# Altium project uartto485.PrjPCB
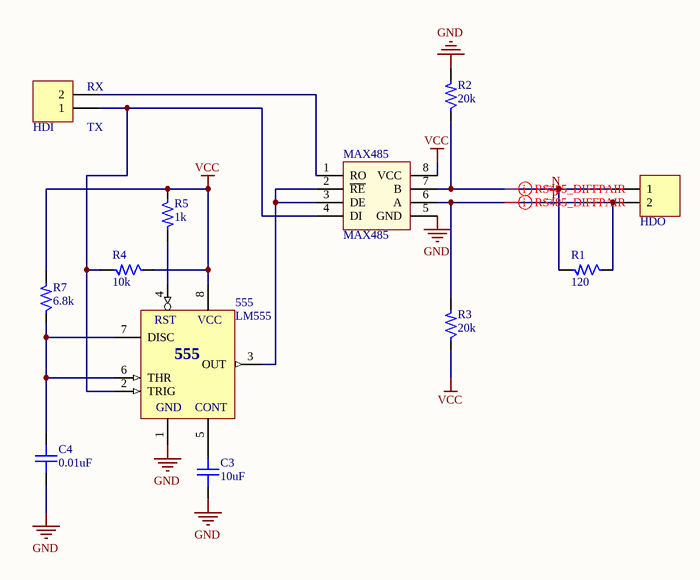
[diagram p0: uartto485.SchDoc]
2 sheets, 19 parts. Net scope: global (net labels, ports and power ports of the same name join across sheets).
Board file: uartto485.PcbDoc
Sheets:
  uartto485.SchDoc
  power.SchDoc

## Sheet uartto485.SchDoc
size A

### Parts
555  LM555  [DIP8/W0.3]
C3  10uF  [CAPC-0603 (1608)]
C4  0.01uF  [CAPC-0603 (1608)]
HDI  Header 2_1  [HED2]  (value not drawn)
HDO  Header 2_1  [HED2]  (value not drawn)
MAX485  MAX485  [DIP8/W0.3]
R1  120  [SM-RES-1206]
R2  20k  [SM-RES-1206]
R3  20k  [SM-RES-1206]
R4  10k  [SM-RES-1206]
R5  1k  [SM-RES-1206]
R7  6.8k  [SM-RES-1206]

### Nets
GND: 555.1(GND) C3.1 C4.1 MAX485.5(GND) R2.2
VCC: 555.8(VCC) MAX485.8(VCC) R3.1 R4.1 R5.1 R7.2
_N: HDO.1 MAX485.7(B) R1.2 R2.1
_P: HDO.2 MAX485.6(A) R1.1 R3.2
Net555_2: 555.2(TRIG) HDI.1 MAX485.4(DI) R4.2
Net555_3: 555.3(OUT) MAX485.2(~{RE}) MAX485.3(DE)
Net555_4: 555.4(RST) R5.2
Net555_5: 555.5(CONT) C3.2
Net555_6: 555.6(THR) 555.7(DISC) C4.2 R7.1
NetHDI_2: HDI.2 MAX485.1(RO)

### Layout directives
differential pair; differential pair class RS485DIFF: _N, _P

### Notes on the sheet
- (near HDI) RX
- (near HDI) TX

### Library data of the parts
555 = LM555: Timer; Value: LM555
C3 C4 = 0603N330J500CT: CAP CER 33pF 50V 5%  0603; MPN: CL10C330JB8NNNC, 0603N330J500CT; CompanyID: VT-01106; Solder: SMT; Value: 33p/50V; Category: CAPACITOR; PinCount: 2
HDI HDO = Header 2_1: Header, 2-Pin; Manufacturer: Generic Components; Class: Connector; Value: Header 2
MAX485 = MAX485: RS232 - RS485 (Same sn75176)
R1-R5 R7 = R: Resistor 1/4W; Value: R1/4W - 1K

## Sheet power.SchDoc
size A
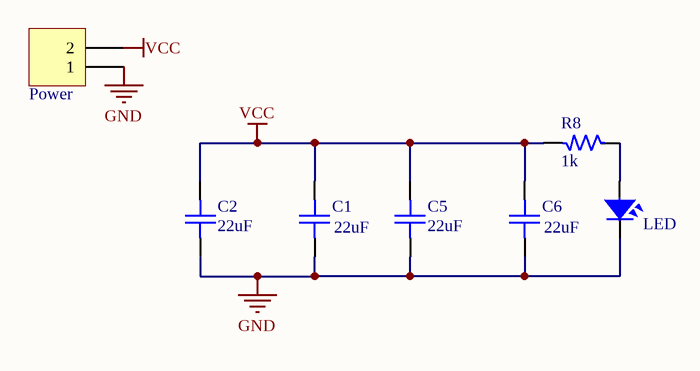
[diagram p1: power.SchDoc]

### Parts
C1  22uF  [CAPC-0603 (1608)]
C2  22uF  [CAPC-0603 (1608)]
C5  22uF  [CAPC-0603 (1608)]
C6  22uF  [CAPC-0603 (1608)]
LED  LED  [LED-3]  (value not drawn)
Power  Header 2_1  [HED2]  (value not drawn)
R8  1k  [SM-RES-1206]

### Nets
GND: C1.1 C2.1 C5.1 C6.1 LED.2 Power.1
VCC: C1.2 C2.2 C5.2 C6.2 Power.2 R8.2
NetLED_1: LED.1 R8.1

### Library data of the parts
C1 C2 C5 C6 = 0603N330J500CT: as C3 on sheet uartto485; Category: CAPACITOR; PinCount: 2
LED = LED: LED Single colour Green and Red; Value: LED 3 ly Single Colour
Power = Header 2_1: as HDI on sheet uartto485; Value: Header 2
R8 = R: Resistor 1/4W; Value: R1/4W - 1K

## Nets that join several sheets
GND: uartto485 (5 pins), power (6 pins)
VCC: uartto485 (6 pins), power (6 pins)